# Altium schematic sheet 5V_power_4A.SchDoc: 5v Regulator 4A
size A4
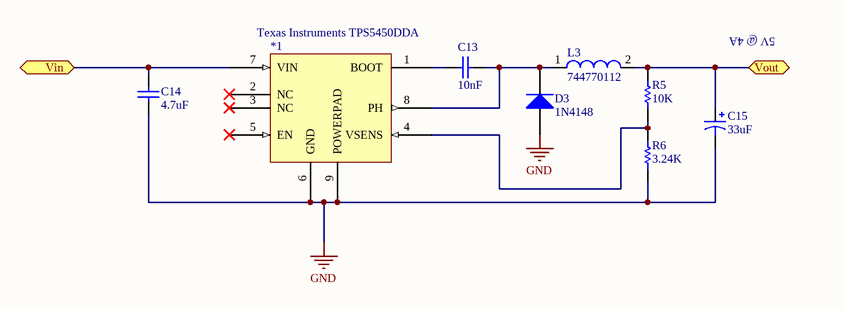
[diagram p0: 5V_power_4A.SchDoc]

## Parts
*1  Texas Instruments TPS5450DDA  [PCB-i2ey7la0otg9s5bbbcx3-1]
C13  10nF  [GRM21BR61H475KE51L]
C14  4.7uF  [GRM21BR61H475KE51L]
C15  33uF  [PCB-m8hbcurj3co3kv9xxxha-1]
D3  1N4148  [PCB-1N4148W-7-F]
L3  744770112  [WE-PD-XL]
R5  10K  [PCB-9ahxsq8gddjqcnfjmojj-1]
R6  3.24K  [PCB-9ahxsq8gddjqcnfjmojj-1]

## Ports
Vin, Vout

## Nets
GND: *1.6(GND) *1.9(POWERPAD) C14.1 C15.2 D3.1(A) R6.1
Vin: *1.7(VIN) C14.2 ; port Vin
Vout: C15.1 L3.2 R5.2 ; port Vout
Net*1_1: *1.1(BOOT) C13.2
Net*1_4: *1.4(VSENS) R5.1 R6.2
Net*1_8: *1.8(PH) C13.1 D3.2(K) L3.1

Not connected (* = marked no-connect by the designer): *1 2(NC)* 3(NC)* 5(EN)*

## Notes on the sheet
- 5V @ 4A
- Title
- Size:
- Date:
- A4
- Engineer:
- Time:
- Sheet
- Revision:
- of
- File:

## Library data of the parts
*1 = TPS5450DDA: Conv DC-DC 5.5V to 36V Step Down Single-Out 1.22V to 31V 5A 8-Pin HSOP EP Tube
C13 C14 = CMP-12577565-9: CAP CER 4.7UF 50V X5R 0805; Capacitance: 4.70 µF; RoHS: Compliant; Mounting Style: Surface Mount; Dielectric Characteristic: X5R
C15 = CMP-3dc2f5bba3b9e205-1: Cap Alum 33UF 20% 35V Radial; Manufacturer Part Number: 35MS533MEFC8X5; Capacitance: 33.0 µF; Voltage Rating (DC): 35.0 V; Octopart URL: https://octopart.com/35ms533mefc8x5-rubycon-24361757; Capacitance Tolerance: ±20%; Mounting Style: Through Hole; Packaging: Bulk; RoHS: Compliant; Size-Diameter: 8.00 mm; Size-Height: 5.00 mm; OctopartID: 3dc2f5bba3b9e205
D3 = CMP-791fb3587d52a6d8-18: Fast Switching Diode, 100V, 400mW, Surface Mount, SOD-123; Manufacturer PN: 1N4148W-7-F; Current Rating: 150 mA; Output Current: 300mA (max); Datasheet PDF: https://www.diodes.com/assets/Datasheets/ds30086.pdf; OctopartID: 791fb3587d52a6d8; Mounting Style: Surface Mount; Voltage Rating (DC): 100V; Octopart URL: https://octopart.com/1n4148w-7-f-diodes+inc.-55386411; Manufacturer Part Number: 1N4148W-7-F; Case/Package: SOD-123; RoHS: Compliant
L3 = 744770112: SMD-Shielded Power Inductor WE-PD, L = 12.0 µH; Inductance: 1.2e-05 H; Resistance: 0.021 Ω; Resonant Frequency: 16000000.0 Hz; Octopart Url: https://octopart.com/744770112-w%C3%BCrth+elektronik-22866871; OctopartID: 395ef108f78fe699; Packaging: Cut Tape (CT); REACH SVHC Compliance: No SVHC; RoHS: Compliant; Self Resonant Frequency: 16000000.0 Hz; Manufacturer Part Number: 744770112
R5 R6 = RMCF0603FT10K0: RMCF Series 0603 Case 10 kOhm ±1 % ±100 ppm/°C SMT Thick Film Chip Resistor; Resistance Tolerance: ±1%; Lead-Free Status: Lead Free; Power Rating: 100 mW; Resistance: 10.0 kΩ; RoHS: Compliant; Octopart URL: http://octopart.com/rmcf0603ft10k0-stackpole+electronics-19212930; OctopartID: 02dfcaf00d3bdd18; Packaging: Tape & Reel (TR); Mounting Style: Surface Mount; Manufacturer Part Number: RMCF0603FT10K0; Case/Package: 0603